# EAGLE schematic car_heater (EAGLE 7.7.0)
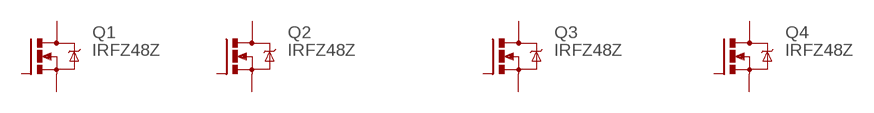
[diagram p0: schematic, sheet 1]

## Parts
Q1  IRFZ48Z  [TO220BH]
Q2  IRFZ48Z  [TO220BH]
Q3  IRFZ48Z  [TO220BH]
Q4  IRFZ48Z  [TO220BH]
Unconnected: Q1.D Q1.G Q1.S Q2.D Q2.G Q2.S Q3.D Q3.G Q3.S Q4.D Q4.G Q4.S

## Library data of the parts
Q1-Q4 = transistor-power:IRFZ48: N Channel HEXFET® Power MOSFET Logic Level Source: http://www.irf.com/product-info/datasheets/data/irfz48z.pdf